# Altium schematic sheet Audio_MIC.SchDoc
size A3; SheetNumber: 5; SheetTotal: 7
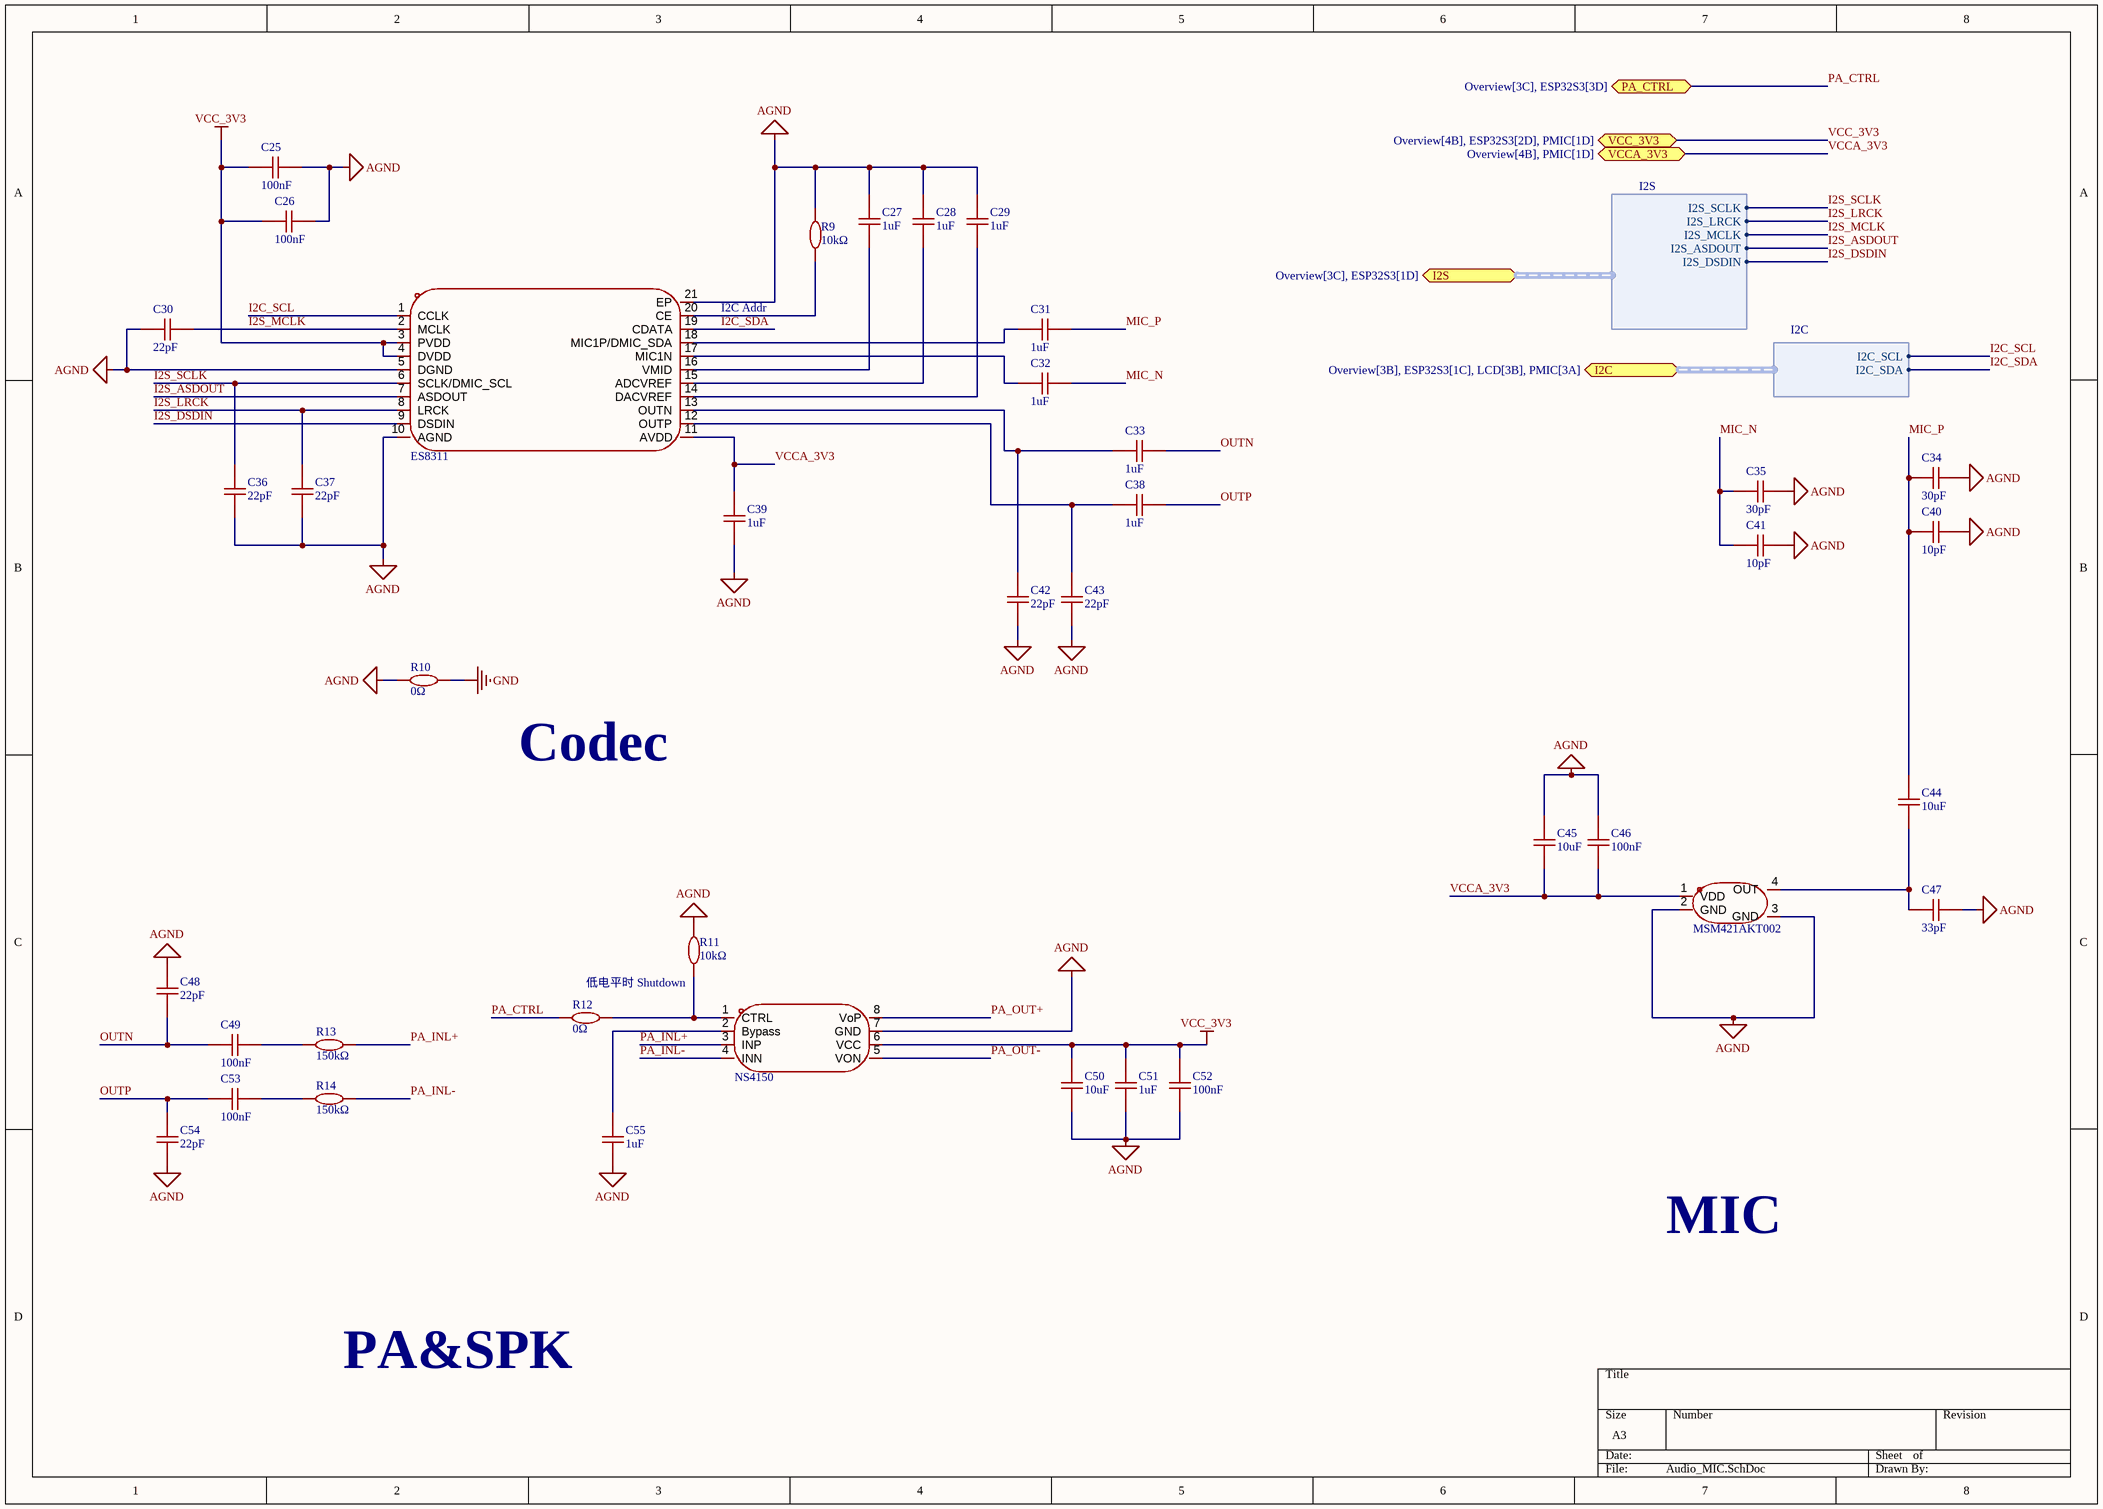
[diagram p0: Audio_MIC.SchDoc]

## Parts
C25  100nF  [C0402]
C26  100nF  [C0402]
C27  1uF  [C0402]
C28  1uF  [C0402]
C29  1uF  [C0402]
C30  22pF  [C0402]
C31  1uF  [C0402]
C32  1uF  [C0402]
C33  1uF  [C0402]
C34  30pF  [C0402]
C35  30pF  [C0402]
C36  22pF  [C0402]
C37  22pF  [C0402]
C38  1uF  [C0402]
C39  1uF  [C0402]
C40  10pF  [C0402]
C41  10pF  [C0402]
C42  22pF  [C0402]
C43  22pF  [C0402]
C44  10uF  [C0603]
C45  10uF  [C0603]
C46  100nF  [C0402]
C47  33pF  [C0402]
C48  22pF  [C0402]
C49  100nF  [C0402]
C50  10uF  [C0603]
C51  1uF  [C0402]
C52  100nF  [C0402]
C53  100nF  [C0402]
C54  22pF  [C0402]
C55  1uF  [C0402]
R9  10kΩ  [R0402]
R10  0Ω  [R0402]
R11  10kΩ  [R0402]
R12  0Ω  [R0402]
R13  150kΩ  [R0402]
R14  150kΩ  [R0402]
U7  ES8311  [WQFN-20_L3.0-W3.0-P0.40-BL-EP1.7]
U8  MSM421AKT002  [LGA-4_L3.8-W3.0-P2.46-TR]
U9  NS4150  [MSOP-8_L3.0-W3.0-P0.65-LS5.0-BL]

## Ports
I2C (bidir, harness I2C, see Overview[3B], ESP32S3[1C], LCD[3B], PMIC[3A]), I2S (bidir, harness I2S, see Overview[3C], ESP32S3[1D]), PA_CTRL (bidir, see Overview[3C], ESP32S3[3D]), VCC_3V3 (bidir, see Overview[4B], ESP32S3[2D], PMIC[1D]), VCCA_3V3 (bidir, see Overview[4B], PMIC[1D])

## Harnesses
I2S: I2S_SCLK, I2S_LRCK, I2S_MCLK, I2S_ASDOUT, I2S_DSDIN
I2C: I2C_SCL, I2C_SDA

## Nets
AGND: C25.1 C26.1 C27.2 C28.2 C29.2 C30.2 C34.2 C35.2 C36.2 C37.2 C39.1 C40.2 C41.2 C42.1 C43.1 C45.2 C46.1 C47.2 C48.1 C50.1 C51.1 C52.2 C54.2 C55.1 R9.2 R10.1 R11.2 U7.5(DGND) U7.10(AGND) U7.21(EP) U8.2(GND) U8.3(GND) U9.7(GND)
GND: R10.2
VCC_3V3: C25.2 C26.2 C50.2 C51.2 C52.1 U7.3(PVDD) U7.4(DVDD) U9.6(VCC) ; port VCC_3V3
I2C_SCL: U7.1(CCLK) ; port I2C.I2C_SCL
I2C_SDA: U7.19(CDATA) ; port I2C.I2C_SDA
I2S_ASDOUT: U7.7(ASDOUT) ; port I2S.I2S_ASDOUT
I2S_DSDIN: U7.9(DSDIN) ; port I2S.I2S_DSDIN
I2S_LRCK: C37.1 U7.8(LRCK) ; port I2S.I2S_LRCK
I2S_MCLK: C30.1 U7.2(MCLK) ; port I2S.I2S_MCLK
I2S_SCLK: C36.1 U7.6(SCLK/DMIC_SCL) ; port I2S.I2S_SCLK
MIC_N: C32.2 C35.1 C41.1
MIC_P: C31.2 C34.1 C40.1 C44.2
OUTN: C33.2 C48.2 C49.2
OUTP: C38.2 C53.2 C54.1
PA_CTRL: R12.1 ; port PA_CTRL
PA_INL+: R13.2 U9.3(INP)
PA_INL-: R14.2 U9.4(INN)
PA_OUT+: U9.8(VoP)
PA_OUT-: U9.5(VON)
VCCA_3V3: C39.2 C45.1 C46.2 U7.11(AVDD) U8.1(VDD) ; port VCCA_3V3
NetC27_1: C27.1 U7.16(VMID)
NetC28_1: C28.1 U7.15(ADCVREF)
NetC29_1: C29.1 U7.14(DACVREF)
NetC31_1: C31.1 U7.18(MIC1P/DMIC_SDA)
NetC32_1: C32.1 U7.17(MIC1N)
NetC33_1: C33.1 C42.2 U7.13(OUTN)
NetC38_1: C38.1 C43.2 U7.12(OUTP)
NetC44_1: C44.1 C47.1 U8.4(OUT)
NetC49_1: C49.1 R13.1
NetC53_1: C53.1 R14.1
NetC55_2: C55.2 U9.2(Bypass)
NetR9_1: R9.1 U7.20(CE)
NetR11_1: R11.1 R12.2 U9.1(CTRL)

## Notes on the sheet
- (near U7) I2C Addr
- Codec
- 低电平时 Shutdown
- MIC
- PA&SPK

## Library data of the parts
C25 C26 C46 C49 C52 C53 = 100nF: 50V 100nF X7R ±10% 0402 Ceramic Capacitors ROHS
C27-C29 C31-C33 C38 C39 C51 C55 = 1uF: 50V 1uF X5R ±10% 0402 Ceramic Capacitors ROHS
C30 C34-C37 C40-C43 C47 C48 C54 = 22pF: 50V 22pF C0G ±5% 0402 Ceramic Capacitors ROHS
C44 C45 C50 = 10uF: 10V 10uF X5R ±10% 0603 Ceramic Capacitors ROHS
R9 R11 = 10kΩ: 62.5mW 10kΩ 50V ±100ppm/℃ Thick Film Resistor ±1% 0402 Chip Resistor - Surface Mount ROHS
R10 R12 = 0Ω: 0Ω 62.5mW 50V Thick Film Resistor ±1% 0402 Chip Resistor - Surface Mount ROHS
R13 R14 = 150kΩ: 62.5mW 150kΩ 50V ±100ppm/℃ Thick Film Resistor ±1% 0402 Chip Resistor - Surface Mount ROHS
U7 = ES8311: 低功耗单声道音频编解码器; Symbol: ES8311
U8 = MSM421AKT002: 全指向型  信噪比 59dB 阻抗; Symbol: MSM421AKT002
U9 = NS4150: 超低EMI、无需滤波器、3W单声道D类音频功放; Symbol: NS4150